# Altium schematic sheet Sequantial Cell Switching.SchDoc
size 431 x 279 mm; SheetNumber: 5; SheetTotal: 8
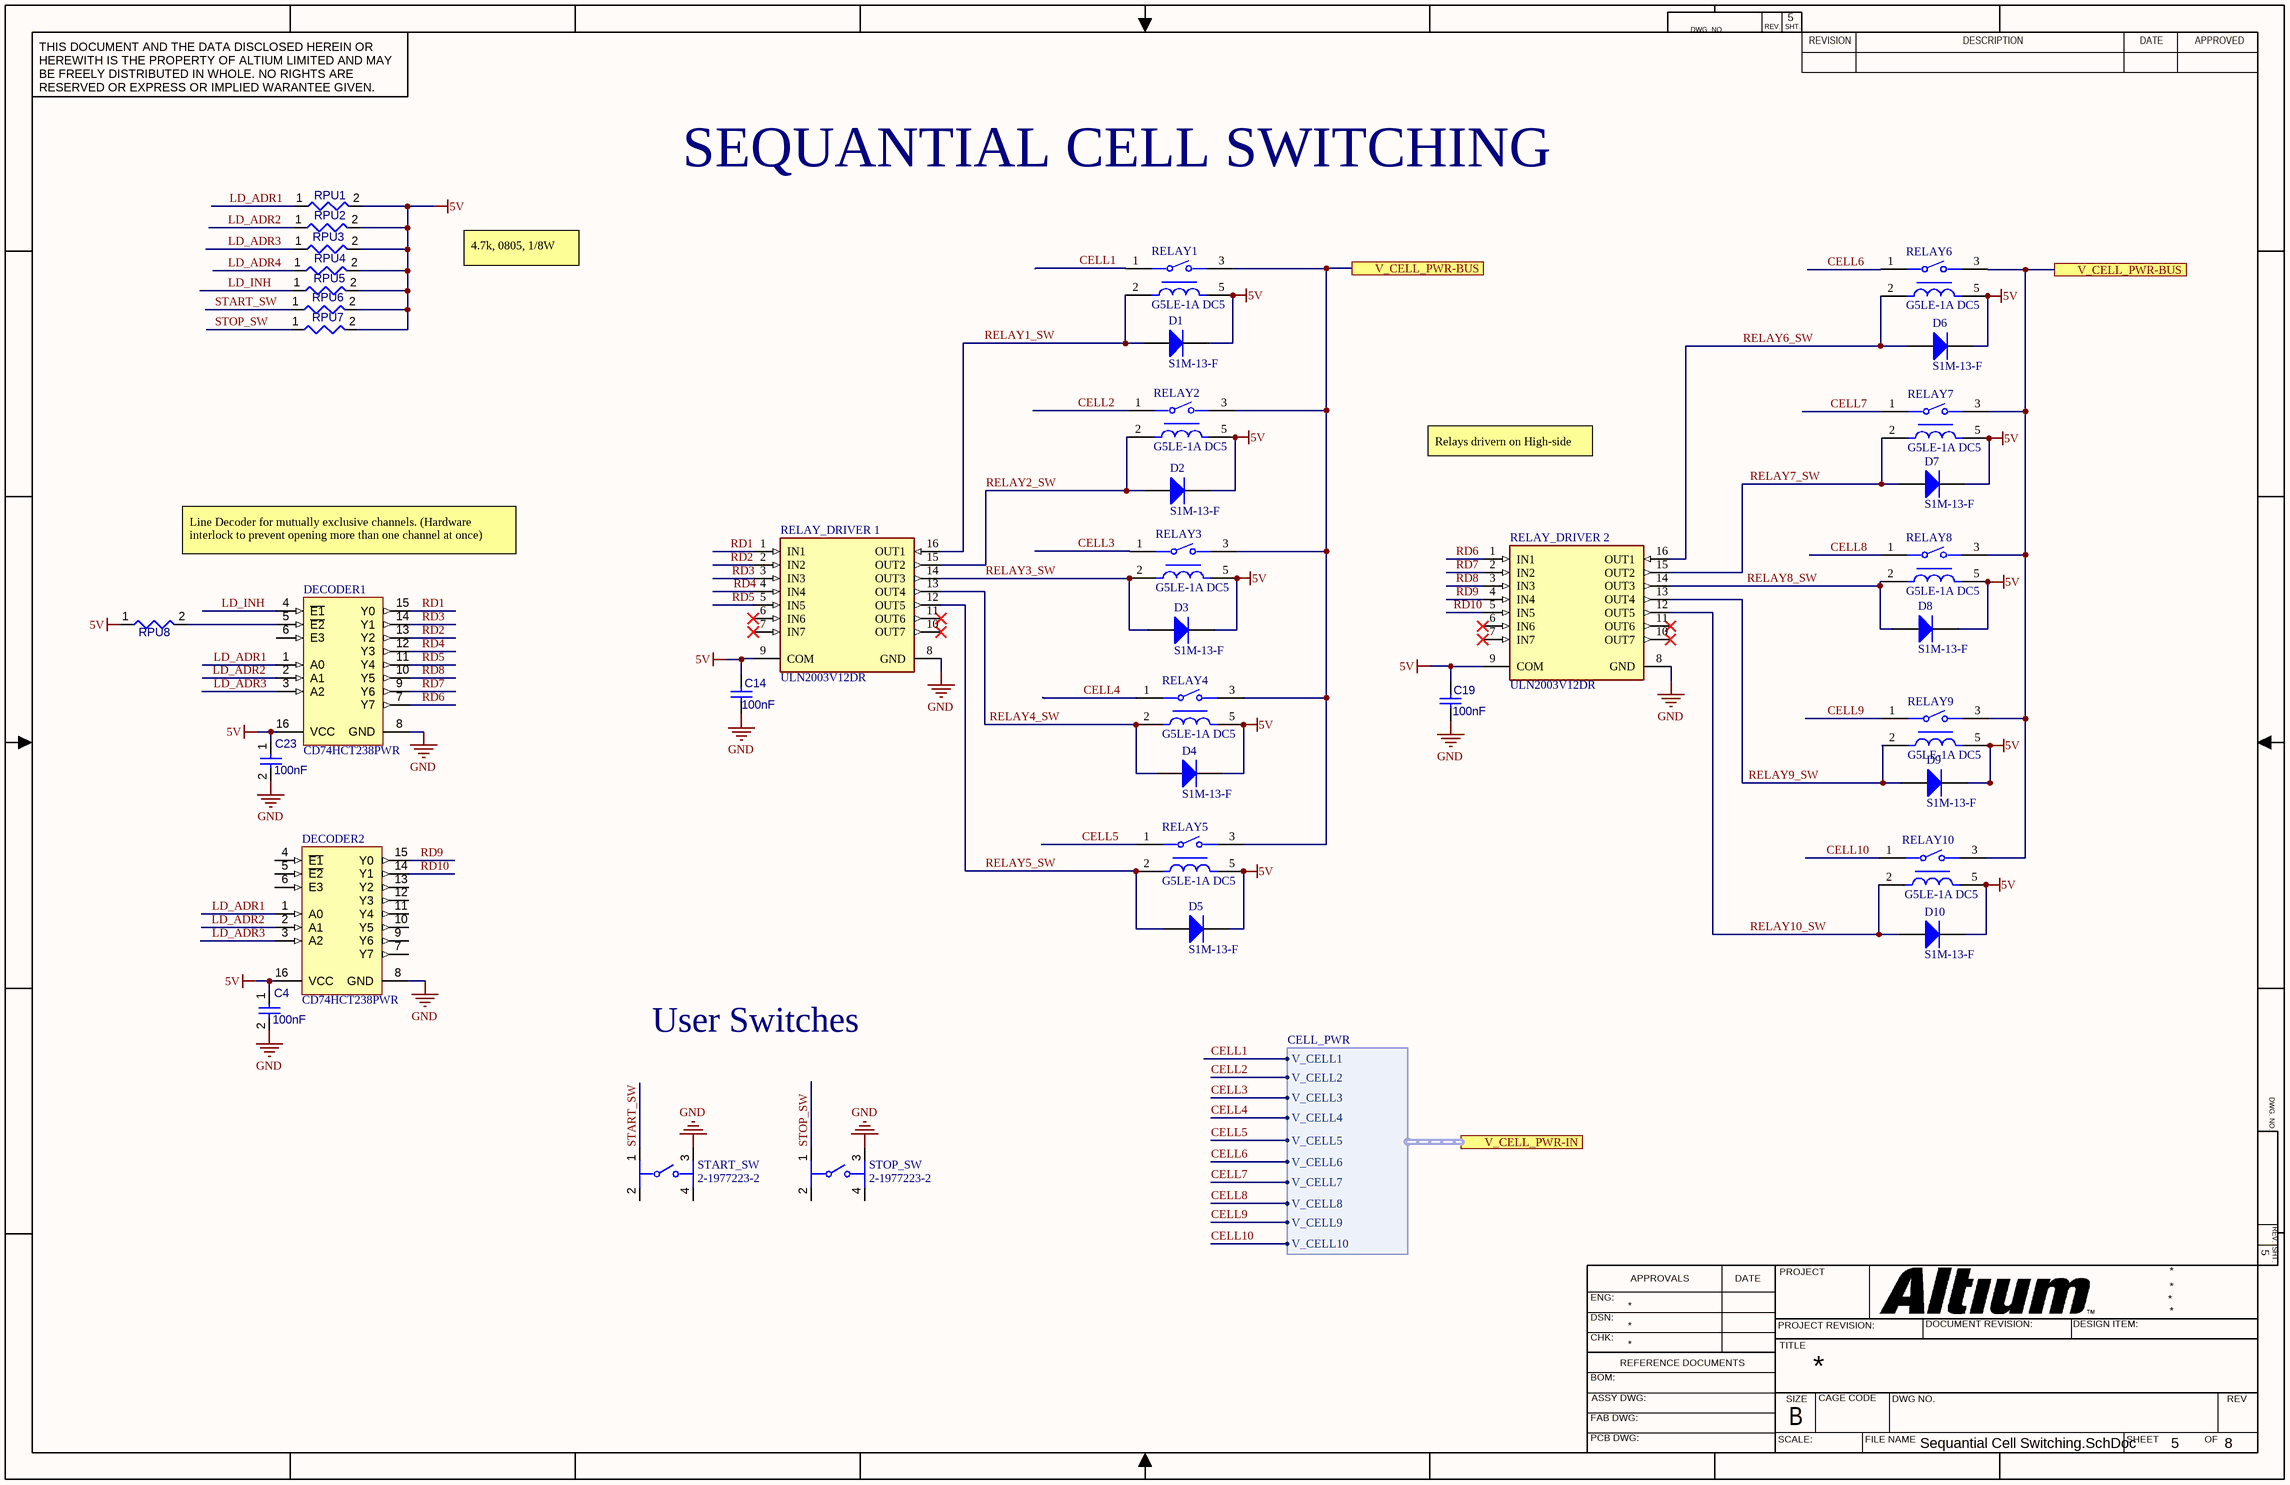
[diagram p0: Sequantial Cell Switching.SchDoc]

## Parts
C4  100nF  [CAPC2013X95X50LL10T25]
C14  100nF  [CAPC2013X95X50LL10T25]
C19  100nF  [CAPC2013X95X50LL10T25]
C23  100nF  [CAPC2013X95X50LL10T25]
D1  S1M-13-F  [DIOD-S1M-13-F-SMA-2_V]
D2  S1M-13-F  [DIOD-S1M-13-F-SMA-2_V]
D3  S1M-13-F  [DIOD-S1M-13-F-SMA-2_V]
D4  S1M-13-F  [DIOD-S1M-13-F-SMA-2_V]
D5  S1M-13-F  [DIOD-S1M-13-F-SMA-2_V]
D6  S1M-13-F  [DIOD-S1M-13-F-SMA-2_V]
D7  S1M-13-F  [DIOD-S1M-13-F-SMA-2_V]
D8  S1M-13-F  [DIOD-S1M-13-F-SMA-2_V]
D9  S1M-13-F  [DIOD-S1M-13-F-SMA-2_V]
D10  S1M-13-F  [DIOD-S1M-13-F-SMA-2_V]
DECODER1  CD74HCT238PWR  [PW0016A_L]
DECODER2  CD74HCT238PWR  [PW0016A_L]
RELAY1  G5LE-1A DC5  [FP-G5LE-1A_DC5-MFG]
RELAY2  G5LE-1A DC5  [FP-G5LE-1A_DC5-MFG]
RELAY3  G5LE-1A DC5  [FP-G5LE-1A_DC5-MFG]
RELAY4  G5LE-1A DC5  [FP-G5LE-1A_DC5-MFG]
RELAY5  G5LE-1A DC5  [FP-G5LE-1A_DC5-MFG]
RELAY6  G5LE-1A DC5  [FP-G5LE-1A_DC5-MFG]
RELAY7  G5LE-1A DC5  [FP-G5LE-1A_DC5-MFG]
RELAY8  G5LE-1A DC5  [FP-G5LE-1A_DC5-MFG]
RELAY9  G5LE-1A DC5  [FP-G5LE-1A_DC5-MFG]
RELAY10  G5LE-1A DC5  [FP-G5LE-1A_DC5-MFG]
RELAY_DRIVER_1  ULN2003V12DR  [FP-D0016A-MFG]
RELAY_DRIVER_2  ULN2003V12DR  [FP-D0016A-MFG]
RPU1  Resistor 4k7 +/-1% 0805 125 mW  [RESC2013X70X40ML20T20]  (value not drawn)
RPU2  Resistor 4k7 +/-1% 0805 125 mW  [RESC2013X70X40ML20T20]  (value not drawn)
RPU3  Resistor 4k7 +/-1% 0805 125 mW  [RESC2013X70X40ML20T20]  (value not drawn)
RPU4  Resistor 4k7 +/-1% 0805 125 mW  [RESC2013X70X40ML20T20]  (value not drawn)
RPU5  Resistor 4k7 +/-1% 0805 125 mW  [RESC2013X70X40ML20T20]  (value not drawn)
RPU6  Resistor 4k7 +/-1% 0805 125 mW  [RESC2013X70X40ML20T20]  (value not drawn)
RPU7  Resistor 4k7 +/-1% 0805 125 mW  [RESC2013X70X40ML20T20]  (value not drawn)
RPU8  Resistor 4k7 +/-1% 0805 125 mW  [RESC2013X70X40ML20T20]  (value not drawn)
START_SW  2-1977223-2  [FP-2-1977223-2-MFG]
STOP_SW  2-1977223-2  [FP-2-1977223-2-MFG]

## Ports
V_CELL_PWR-BUS, V_CELL_PWR-IN (harness CELL_PWR)

## Harnesses
CELL_PWR: V_CELL1, V_CELL2, V_CELL3, V_CELL4, V_CELL5, V_CELL6, V_CELL7, V_CELL8, V_CELL9, V_CELL10

## Nets
5V: C4.1 C14.2 C19.2 C23.1 D1.2(K) D2.2(K) D3.2(K) D4.2(K) D5.2(K) D6.2(K) D7.2(K) D8.2(K) D9.2(K) D10.2(K) DECODER1.16(VCC) DECODER2.16(VCC) RELAY1.5 RELAY2.5 RELAY3.5 RELAY4.5 RELAY5.5 RELAY6.5 RELAY7.5 RELAY8.5 RELAY9.5 RELAY10.5 RELAY_DRIVER_1.9(COM) RELAY_DRIVER_2.9(COM) RPU1.2 RPU2.2 RPU3.2 RPU4.2 RPU5.2 RPU6.2 RPU7.2 RPU8.1
GND: C4.2 C14.1 C19.1 C23.2 DECODER1.8(GND) DECODER2.8(GND) RELAY_DRIVER_1.8(GND) RELAY_DRIVER_2.8(GND) START_SW.3 STOP_SW.3
CELL1: RELAY1.1 ; port V_CELL_PWR-IN.V_CELL1
CELL2: RELAY2.1 ; port V_CELL_PWR-IN.V_CELL2
CELL3: RELAY3.1 ; port V_CELL_PWR-IN.V_CELL3
CELL4: RELAY4.1 ; port V_CELL_PWR-IN.V_CELL4
CELL5: RELAY5.1 ; port V_CELL_PWR-IN.V_CELL5
CELL6: RELAY6.1 ; port V_CELL_PWR-IN.V_CELL6
CELL7: RELAY7.1 ; port V_CELL_PWR-IN.V_CELL7
CELL8: RELAY8.1 ; port V_CELL_PWR-IN.V_CELL8
CELL9: RELAY9.1 ; port V_CELL_PWR-IN.V_CELL9
CELL10: RELAY10.1 ; port V_CELL_PWR-IN.V_CELL10
LD_ADR1: DECODER1.1(A0) DECODER2.1(A0) RPU1.1
LD_ADR2: DECODER1.2(A1) DECODER2.2(A1) RPU2.1
LD_ADR3: DECODER1.3(A2) DECODER2.3(A2) RPU3.1
LD_ADR4: RPU4.1
LD_INH: DECODER1.4(~{E1}) RPU5.1
RD1: DECODER1.15(Y0) RELAY_DRIVER_1.1(IN1)
RD2: DECODER1.13(Y2) RELAY_DRIVER_1.2(IN2)
RD3: DECODER1.14(Y1) RELAY_DRIVER_1.3(IN3)
RD4: DECODER1.12(Y3) RELAY_DRIVER_1.4(IN4)
RD5: DECODER1.11(Y4) RELAY_DRIVER_1.5(IN5)
RD6: DECODER1.7(Y7) RELAY_DRIVER_2.1(IN1)
RD7: DECODER1.9(Y6) RELAY_DRIVER_2.2(IN2)
RD8: DECODER1.10(Y5) RELAY_DRIVER_2.3(IN3)
RD9: DECODER2.15(Y0) RELAY_DRIVER_2.4(IN4)
RD10: DECODER2.14(Y1) RELAY_DRIVER_2.5(IN5)
RELAY1_SW: D1.1(A) RELAY1.2 RELAY_DRIVER_1.16(OUT1)
RELAY2_SW: D2.1(A) RELAY2.2 RELAY_DRIVER_1.15(OUT2)
RELAY3_SW: D3.1(A) RELAY3.2 RELAY_DRIVER_1.14(OUT3)
RELAY4_SW: D4.1(A) RELAY4.2 RELAY_DRIVER_1.13(OUT4)
RELAY5_SW: D5.1(A) RELAY5.2 RELAY_DRIVER_1.12(OUT5)
RELAY6_SW: D6.1(A) RELAY6.2 RELAY_DRIVER_2.16(OUT1)
RELAY7_SW: D7.1(A) RELAY7.2 RELAY_DRIVER_2.15(OUT2)
RELAY8_SW: D8.1(A) RELAY8.2 RELAY_DRIVER_2.14(OUT3)
RELAY9_SW: D9.1(A) RELAY9.2 RELAY_DRIVER_2.13(OUT4)
RELAY10_SW: D10.1(A) RELAY10.2 RELAY_DRIVER_2.12(OUT5)
START_SW: RPU6.1 START_SW.1
STOP_SW: RPU7.1 STOP_SW.1
V_CELL_PWR-BUS: RELAY1.3 RELAY2.3 RELAY3.3 RELAY4.3 RELAY5.3 RELAY6.3 RELAY7.3 RELAY8.3 RELAY9.3 RELAY10.3 ; port V_CELL_PWR-BUS
NetDECODER1_5: DECODER1.5(~{E2}) RPU8.2

Not connected (* = marked no-connect by the designer): DECODER1 6(E3); DECODER2 4(~{E1}) 5(~{E2}) 6(E3) 7(Y7) 9(Y6) 10(Y5) 11(Y4) 12(Y3) 13(Y2); RELAY_DRIVER_1 6(IN6)* 7(IN7)* 10(OUT7)* 11(OUT6)*; RELAY_DRIVER_2 6(IN6)* 7(IN7)* 10(OUT7)* 11(OUT6)*; START_SW 2 4; STOP_SW 2 4

## Notes on the sheet
- SEQUANTIAL CELL SWITCHING
- 4.7k, 0805, 1/8W
- Relays drivern on High-side
- Line Decoder for mutually exclusive channels. (Hardware interlock to prevent opening more than one channel at once)
- User Switches
- DWG. NO.
- REV.
- SHT.
- THIS DOCUMENT AND THE DATA DISCLOSED HEREIN OR HEREWITH IS THE PROPERTY OF ALTIUM LIMITED AND MAY BE FREELY DISTRIBUTED IN WHOLE. NO RIGHTS ARE RESERVED OR EXPRESS OR IMPLIED WARANTEE GIVEN.
- REVISION
- DESCRIPTION
- DATE
- APPROVED
- ENG:
- APPROVALS
- PROJECT
- DSN:
- CHK:
- REFERENCE DOCUMENTS
- PROJECT REVISION:
- TITLE
- DOCUMENT REVISION:
- DESIGN ITEM:
- BOM:
- FAB DWG:
- PCB DWG:
- ASSY DWG:
- SCALE:
- SIZE
- B
- CAGE CODE
- FILE NAME
- DWG NO.
- SHEET
- OF
- REV

## Library data of the parts
C4 C14 C19 C23 = CMP-001-00018-6: Capacitor 100 nF +/-10% 50 V 0805; Voltage Rating: 50V; Tolerance: 10%; Capacitor Type: Ceramic; Value: 100nF; Pins: 2; Max Operating Temperature: 125°C; Min Operating Temperature: -55°C; Mounting Technology: SM; Case/Package: 0805; RoHS Compliant: True
D1-D10 = CMP-0639-00001-1: Surface Mount Glass Passivated Rectifier, 1000V, 1 A, -65 to 125 degC, 2-Pin SMA Package, RoHS, Tape and Reel; Manufacturer: Diodes Inc; Maximum Reverse Current IR (uA): 5; Maximum Peak Forward Surge Current IFSM (A): 30; Maximum Average Rectified Current IO (A): 1; Peak Repetitive Reverse Voltage VRRM (V): 1000; Total Capacitance CT (pF): 10; Forward Voltage Drop VF (V): 1.1; ComponentLink1URL: http://www.diodes.com/; Operating Temperature Range: -65 to 150 degC; ComponentLink3URL: http://diodes.com/datasheets/ds16003.pdf; ComponentLink3Description: Package Specification; PackageDescription: 2-Pin SMD, Body 4.3 x 2.605 mm, Height 2.3 mm; Mounting Technology: Surface Mount; ComponentLink1Description: Manufacturer URL; PackageReference: S1M-13-F-SMA-2; ComponentLink2URL: http://diodes.com/datasheets/ds16003.pdf; ComponentLink2Description: Datasheet; RoHS: TRUE; DatasheetVersion: Rev. 22 - 2; Packing: Tape and Reel; PackageVersion: Rev. 22 - 2; PartNumber: S1M-13-F
DECODER1 DECODER2 = CMP-1633-00901-2: High Speed CMOS Logic 3-to-8 Line Decoder Demultiplexer Inverting and Non-Inverting, PW0016A, LARGE T&R; Manufacturer: Texas Instruments; Input Type: TTL; Technology Family: HCT; VCC(Max)(V): 5.5; VCC(Min)(V): 4.5; ICC @ Nom Voltage(Max)(mA): 0.08; F @ Nom Voltage(Max)(Mhz): 25; Voltage(Nom)(V): 5; Schmitt Trigger: No; Bits(#): 8; Function: Decoder/Demultiplexer; Rating: Catalog; tpd @ Nom Voltage(Max)(ns): 35; Configuration: 3：8; Output Drive (IOL/IOH)(Max)(mA): 4/-4; Channels(#): 1; PackageReference: PW0016A; Type: Standard; Code_JEDEC: MO-153; DatasheetVersion: SCHS147I; Operating Temperature Range(C): -55 to 125; Output Type: CMOS; Generic Part Number: CD74HCT238
RELAY1-RELAY10 = CMP-08822-000152-1: RELAY GEN PURPOSE SPST 10A 5V; Coil Resistance: 63R; Power Rating: 400mW; Max Voltage Rating (AC): 250V; Release Time: 5ms; Max Voltage Rating (DC): 125V; Coil Current: 79.4mA; Coil Type: Non-Latching; Operate Time: 10ms; Relay Type: General Purpose; Coil Voltage (DC): 5V; RoHS Compliant: Yes; Power Consumption: 400mW; Package Quantity: 500; Max Operating Temperature: 85°C; Termination: Solder; Length: 22.5mm; Packaging: Tray; Number of Pins: 4; Max Current Rating: 10A; Mount: Through Hole; Height: 19mm; Throw Configuration: SPST; Min Operating Temperature: -40°C; Coil Power: 400mW; Contact Material: Tin; Contact Current Rating: 10A; Weight: 12g; Lead Free: Lead Free; Width: 16.5mm
RELAY_DRIVER_1 RELAY_DRIVER_2 = CMP-04912-000075-1: MOSFET 7CH 16SOIC; Power Dissipation: 860mW; Output Current: 140mA; Collector Emitter Voltage (VCEO): 20V; Collector Emitter Saturation Voltage: 750mV; Output Voltage: 16V; Number of Drivers: 7; Number of Pins: 16; RoHS Compliant: Yes; Height: 1.5mm; Package Quantity: 1; REACH SVHC: No SVHC; Series: -; Min Operating Temperature: -40°C; Max Power Dissipation: 860mW; Max Collector Current: 140mA; Mount: Surface Mount; Packaging: Tape and Reel; Radiation Hardening: No; Case/Package: SOIC; Max Operating Temperature: 85°C; Number of Outputs: 7; Lead Free: Lead Free; Width: 4mm; Weight: 0.004998oz; Length: 10mm
RPU1-RPU8 = CMP-009-00032-5: Chip Resistor, 4.7 KOhm, +/- 1%, 0.125 W, -55 to 155 degC, 0805 (2012 Metric); Value: 4.7k; Voltage Rating: 150V; Power: 125mW; Tolerance: 1%; Mounting Technology: SM; RoHS Compliant: True; Min Operating Temperature: -55°C; Max Operating Temperature: 155°C; Case/Package: 0805; Pins: 2
START_SW STOP_SW = CMP-03407-000026-1: SWITCH TACTILE SPST-NO 0.05A 24V; RoHS Compliant: Yes